# Altium schematic sheet Optogentics_Controller.SchDoc
size A4
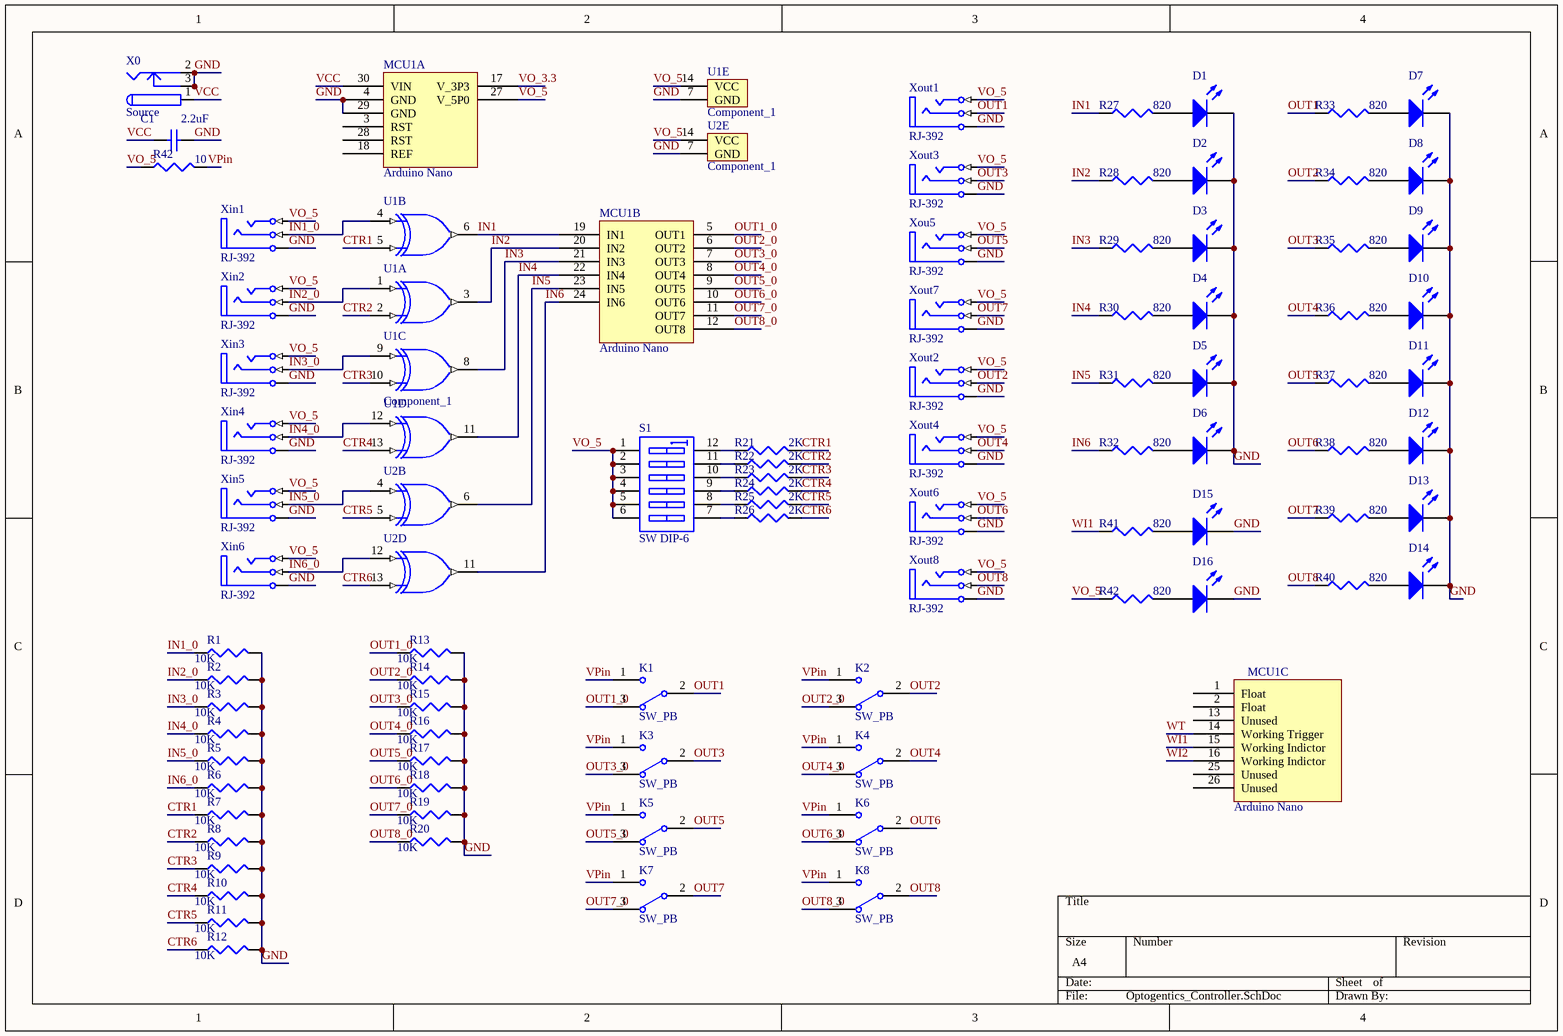
[diagram p0: Optogentics_Controller.SchDoc]

## Parts
(Parts that share a designator on the sheet are numbered #1, #2 ... from top to bottom, then left to right.)
C1  value 2.2uF  [0402]  (hidden comment: Cap Semi)
D1  LED2  [0402-A]  (value not drawn)
D2  LED2  [0402-A]  (value not drawn)
D3  LED2  [0402-A]  (value not drawn)
D4  LED2  [0402-A]  (value not drawn)
D5  LED2  [0402-A]  (value not drawn)
D6  LED2  [0402-A]  (value not drawn)
D7  LED2  [0402-A]  (value not drawn)
D8  LED2  [0402-A]  (value not drawn)
D9  LED2  [0402-A]  (value not drawn)
D10  LED2  [0402-A]  (value not drawn)
D11  LED2  [0402-A]  (value not drawn)
D12  LED2  [0402-A]  (value not drawn)
D13  LED2  [0402-A]  (value not drawn)
D14  LED2  [0402-A]  (value not drawn)
D15  LED2  [HDR1X2]  (value not drawn)
D16  LED2  [HDR1X2]  (value not drawn)
K1  SW_PB  [SW_PB]
K2  SW_PB  [SW_PB]
K3  SW_PB  [SW_PB]
K4  SW_PB  [SW_PB]
K5  SW_PB  [SW_PB]
K6  SW_PB  [SW_PB]
K7  SW_PB  [SW_PB]
K8  SW_PB  [SW_PB]
MCU1  Arduino Nano  [Arduino Nano]  (parts A,B,C of 3)
R1  value 10K  [0402]  (hidden comment: Res3)
R2  value 10K  [0402]  (hidden comment: Res3)
R3  value 10K  [0402]  (hidden comment: Res3)
R4  value 10K  [0402]  (hidden comment: Res3)
R5  value 10K  [0402]  (hidden comment: Res3)
R6  value 10K  [0402]  (hidden comment: Res3)
R7  value 10K  [0402]  (hidden comment: Res3)
R8  value 10K  [0402]  (hidden comment: Res3)
R9  value 10K  [0402]  (hidden comment: Res3)
R10  value 10K  [0402]  (hidden comment: Res3)
R11  value 10K  [0402]  (hidden comment: Res3)
R12  value 10K  [0402]  (hidden comment: Res3)
R13  value 10K  [0402]  (hidden comment: Res3)
R14  value 10K  [0402]  (hidden comment: Res3)
R15  value 10K  [0402]  (hidden comment: Res3)
R16  value 10K  [0402]  (hidden comment: Res3)
R17  value 10K  [0402]  (hidden comment: Res3)
R18  value 10K  [0402]  (hidden comment: Res3)
R19  value 10K  [0402]  (hidden comment: Res3)
R20  value 10K  [0402]  (hidden comment: Res3)
R21  value 2K  [0402]  (hidden comment: Res3)
R22  value 2K  [0402]  (hidden comment: Res3)
R23  value 2K  [0402]  (hidden comment: Res3)
R24  value 2K  [0402]  (hidden comment: Res3)
R25  value 2K  [0402]  (hidden comment: Res3)
R26  value 2K  [0402]  (hidden comment: Res3)
R27  value 820  [0402]  (hidden comment: Res3)
R28  value 820  [0402]  (hidden comment: Res3)
R29  value 820  [0402]  (hidden comment: Res3)
R30  value 820  [0402]  (hidden comment: Res3)
R31  value 820  [0402]  (hidden comment: Res3)
R32  value 820  [0402]  (hidden comment: Res3)
R33  value 820  [0402]  (hidden comment: Res3)
R34  value 820  [0402]  (hidden comment: Res3)
R35  value 820  [0402]  (hidden comment: Res3)
R36  value 820  [0402]  (hidden comment: Res3)
R37  value 820  [0402]  (hidden comment: Res3)
R38  value 820  [0402]  (hidden comment: Res3)
R39  value 820  [0402]  (hidden comment: Res3)
R40  value 820  [0402]  (hidden comment: Res3)
R41  value 820  [0402]  (hidden comment: Res3)
R42#1  value 10  [C0805]  (hidden comment: Res3)
R42#2  value 820  [0402]  (hidden comment: Res3)
S1  SW DIP-6  [DIP-12/SW]
U1  Component_1  [MM74HC86]  (value not drawn)  (parts A,B,C,D,E of 5)
U2  Component_1  [MM74HC86]  (value not drawn)  (parts B,D,E of 5)
X0  Source  [PWR]
Xin1  RJ-392  [Connectors]
Xin2  RJ-392  [Connectors]
Xin3  RJ-392  [Connectors]
Xin4  RJ-392  [Connectors]
Xin5  RJ-392  [Connectors]
Xin6  RJ-392  [Connectors]
Xou5  RJ-392  [Connectors]
Xout1  RJ-392  [Connectors]
Xout2  RJ-392  [Connectors]
Xout3  RJ-392  [Connectors]
Xout4  RJ-392  [Connectors]
Xout6  RJ-392  [Connectors]
Xout7  RJ-392  [Connectors]
Xout8  RJ-392  [Connectors]

## Nets
CTR1: R7.1 R21.2 U1.5(B2)
CTR2: R8.1 R22.2 U1.2(B1)
CTR3: R9.1 R23.2 U1.10(B3)
CTR4: R10.1 R24.2 U1.13(B4)
CTR5: R11.1 R25.2 U2.5(B2)
CTR6: R12.1 R26.2 U2.13(B4)
GND: C1.2 D1.2(K) D2.2(K) D3.2(K) D4.2(K) D5.2(K) D6.2(K) D7.2(K) D8.2(K) D9.2(K) D10.2(K) D11.2(K) D12.2(K) D13.2(K) D14.2(K) D15.2(K) D16.2(K) MCU1.4(GND) MCU1.29(GND) R1.2 R2.2 R3.2 R4.2 R5.2 R6.2 R7.2 R8.2 R9.2 R10.2 R11.2 R12.2 R13.2 R14.2 R15.2 R16.2 R17.2 R18.2 R19.2 R20.2 U1.7(GND) U2.7(GND) X0.2 X0.3 Xin1.1(Pin1) Xin2.1(Pin1) Xin3.1(Pin1) Xin4.1(Pin1) Xin5.1(Pin1) Xin6.1(Pin1) Xou5.1(Pin1) Xout1.1(Pin1) Xout2.1(Pin1) Xout3.1(Pin1) Xout4.1(Pin1) Xout6.1(Pin1) Xout7.1(Pin1) Xout8.1(Pin1)
IN1: MCU1.19(IN1) R27.1 U1.6(Y2)
IN1_0: R1.1 U1.4(A2) Xin1.3(Pin3)
IN2: MCU1.20(IN2) R28.1 U1.3(Y1)
IN2_0: R2.1 U1.1(A1) Xin2.3(Pin3)
IN3: MCU1.21(IN3) R29.1 U1.8(Y3)
IN3_0: R3.1 U1.9(A3) Xin3.3(Pin3)
IN4: MCU1.22(IN4) R30.1 U1.11(Y4)
IN4_0: R4.1 U1.12(A4) Xin4.3(Pin3)
IN5: MCU1.23(IN5) R31.1 U2.6(Y2)
IN5_0: R5.1 U2.4(A2) Xin5.3(Pin3)
IN6: MCU1.24(IN6) R32.1 U2.11(Y4)
IN6_0: R6.1 U2.12(A4) Xin6.3(Pin3)
OUT1: K1.2(COM) R33.1 Xout1.3(Pin3)
OUT1_0: K1.3(NC) MCU1.5(OUT1) R13.1
OUT2: K2.2(COM) R34.1 Xout2.3(Pin3)
OUT2_0: K2.3(NC) MCU1.6(OUT2) R14.1
OUT3: K3.2(COM) R35.1 Xout3.3(Pin3)
OUT3_0: K3.3(NC) MCU1.7(OUT3) R15.1
OUT4: K4.2(COM) R36.1 Xout4.3(Pin3)
OUT4_0: K4.3(NC) MCU1.8(OUT4) R16.1
OUT5: K5.2(COM) R37.1 Xou5.3(Pin3)
OUT5_0: K5.3(NC) MCU1.9(OUT5) R17.1
OUT6: K6.2(COM) R38.1 Xout6.3(Pin3)
OUT6_0: K6.3(NC) MCU1.10(OUT6) R18.1
OUT7: K7.2(COM) R39.1 Xout7.3(Pin3)
OUT7_0: K7.3(NC) MCU1.11(OUT7) R19.1
OUT8: K8.2(COM) R40.1 Xout8.3(Pin3)
OUT8_0: K8.3(NC) MCU1.12(OUT8) R20.1
VCC: C1.1 MCU1.30(VIN) X0.1
VO_3.3: MCU1.17(V_3P3)
VO_5: MCU1.27(V_5P0) R42#1.1 R42#2.1 S1.1(A1) S1.2(A2) S1.3(A3) S1.4(A4) S1.5(A5) S1.6(A6) U1.14(VCC) U2.14(VCC) Xin1.2(Pin2) Xin2.2(Pin2) Xin3.2(Pin2) Xin4.2(Pin2) Xin5.2(Pin2) Xin6.2(Pin2) Xou5.2(Pin2) Xout1.2(Pin2) Xout2.2(Pin2) Xout3.2(Pin2) Xout4.2(Pin2) Xout6.2(Pin2) Xout7.2(Pin2) Xout8.2(Pin2)
VPin: K1.1(NO) K2.1(NO) K3.1(NO) K4.1(NO) K5.1(NO) K6.1(NO) K7.1(NO) K8.1(NO) R42#1.2
WI1: MCU1.15(Working_Indictor) R41.1
WI2: MCU1.16(Working_Indictor)
WT: MCU1.14(Working_Trigger)
NetD1_1: D1.1(A) R27.2
NetD2_1: D2.1(A) R28.2
NetD3_1: D3.1(A) R29.2
NetD4_1: D4.1(A) R30.2
NetD5_1: D5.1(A) R31.2
NetD6_1: D6.1(A) R32.2
NetD7_1: D7.1(A) R33.2
NetD8_1: D8.1(A) R34.2
NetD9_1: D9.1(A) R35.2
NetD10_1: D10.1(A) R36.2
NetD11_1: D11.1(A) R37.2
NetD12_1: D12.1(A) R38.2
NetD13_1: D13.1(A) R39.2
NetD14_1: D14.1(A) R40.2
NetD15_1: D15.1(A) R41.2
NetD16_1: D16.1(A) R42#2.2
NetR21_1: R21.1 S1.12(B1)
NetR22_1: R22.1 S1.11(B2)
NetR23_1: R23.1 S1.10(B3)
NetR24_1: R24.1 S1.9(B4)
NetR25_1: R25.1 S1.8(B5)
NetR26_1: R26.1 S1.7(B6)

Not connected (* = marked no-connect by the designer): MCU1 1(Float) 2(Float) 3(RST) 13(Unused) 18(REF) 25(Unused) 26(Unused) 28(RST)

## Library data of the parts
C1 = Cap Semi: Capacitor (Semiconductor SIM Model); Published: 8-Jun-2000; LatestRevisionDate: 29-May-2009; LatestRevisionNote: IPC-7351 Footprint Added.; PackageReference: C1206; Publisher: Altium Limited; PackageDescription: Chip Capacitor
D1-D14 = LED2: Typical RED, GREEN, YELLOW, AMBER GaAs LED; pin to pad: 1>2 2>1; Published: 8-Jun-2000; LatestRevisionDate: 17-Jul-2002; LatestRevisionNote: Re-released for DXP Platform.; PackageVersion: Feb-2002; PackageReference: 3.2X1.6X1.1; Publisher: Altium Limited; PackageDescription: SM LED; 2 Flat Leads
D15 D16 = LED2: Typical RED, GREEN, YELLOW, AMBER GaAs LED; Published: 8-Jun-2000; LatestRevisionDate: 17-Jul-2002; LatestRevisionNote: Re-released for DXP Platform.; PackageVersion: Feb-2002; PackageReference: 3.2X1.6X1.1; Publisher: Altium Limited; PackageDescription: SM LED; 2 Flat Leads
R1-R41 R42#1 R42#2 = Res3: Resistor; Published: 8-Jun-2000; LatestRevisionDate: 29-May-2009; LatestRevisionNote: IPC-7351 Footprint Added.; PackageReference: J1-0603; Publisher: Altium Limited; PackageDescription: Chip Resistor
S1 = SW DIP-6: DIP Switch, 6 Position, SPST; Published: 24-Mar-1999; LatestRevisionDate: 17-Jul-2002; LatestRevisionNote: Re-released for DXP Platform.; PackageReference: DIP-12/SW; Publisher: Altium Limited; PackageDescription: DIP Switch; 12 Leads